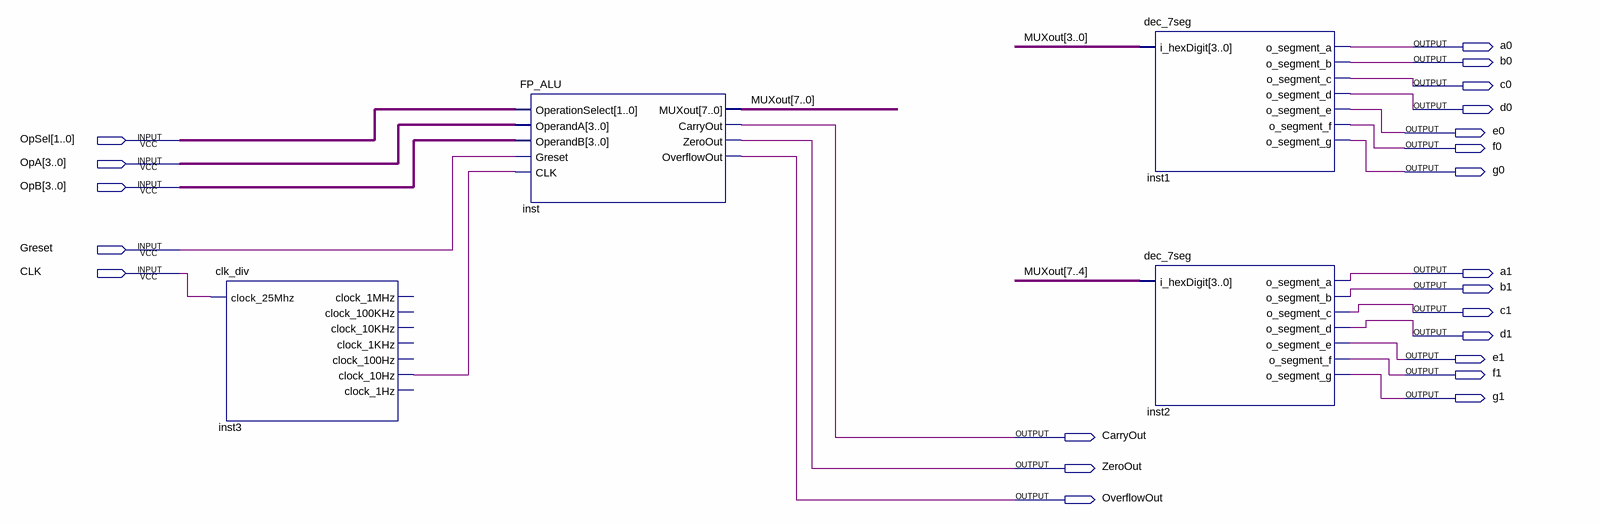
[diagram p0: schematic sheet]
// Quartus schematic ToplvlEntity.bdf as structural Verilog: 4 symbols, 22 pins
module ToplvlEntity (
  input  [1:0] OpSel,
  input  [3:0] OpA,
  input  [3:0] OpB,
  input  Greset,
  input  CLK,
  output a0,
  output b0,
  output c0,
  output d0,
  output e0,
  output f0,
  output g0,
  output a1,
  output b1,
  output c1,
  output d1,
  output e1,
  output f1,
  output g1,
  output CarryOut,
  output ZeroOut,
  output OverflowOut
);

  wire inst3_clock_10hz;
  wire [7:0] MUXout;

  clk_div inst3 (
    .clock_25Mhz(CLK), .clock_10Hz(inst3_clock_10hz));  // open: clock_1MHz, clock_100KHz, clock_10KHz, clock_1KHz, clock_100Hz, clock_1Hz
  FP_ALU inst (
    .OperationSelect(OpSel), .OperandA(OpA), .OperandB(OpB), .Greset(Greset), .CLK(inst3_clock_10hz),
    .MUXout(MUXout), .CarryOut(CarryOut), .ZeroOut(ZeroOut), .OverflowOut(OverflowOut));
  dec_7seg inst1 (
    .i_hexDigit(MUXout[3:0]), .o_segment_a(a0), .o_segment_b(b0), .o_segment_c(c0), .o_segment_d(d0),
    .o_segment_e(e0), .o_segment_f(f0), .o_segment_g(g0));
  dec_7seg inst2 (
    .i_hexDigit(MUXout[7:4]), .o_segment_a(a1), .o_segment_b(b1), .o_segment_c(c1), .o_segment_d(d1),
    .o_segment_e(e1), .o_segment_f(f1), .o_segment_g(g1));
endmodule
